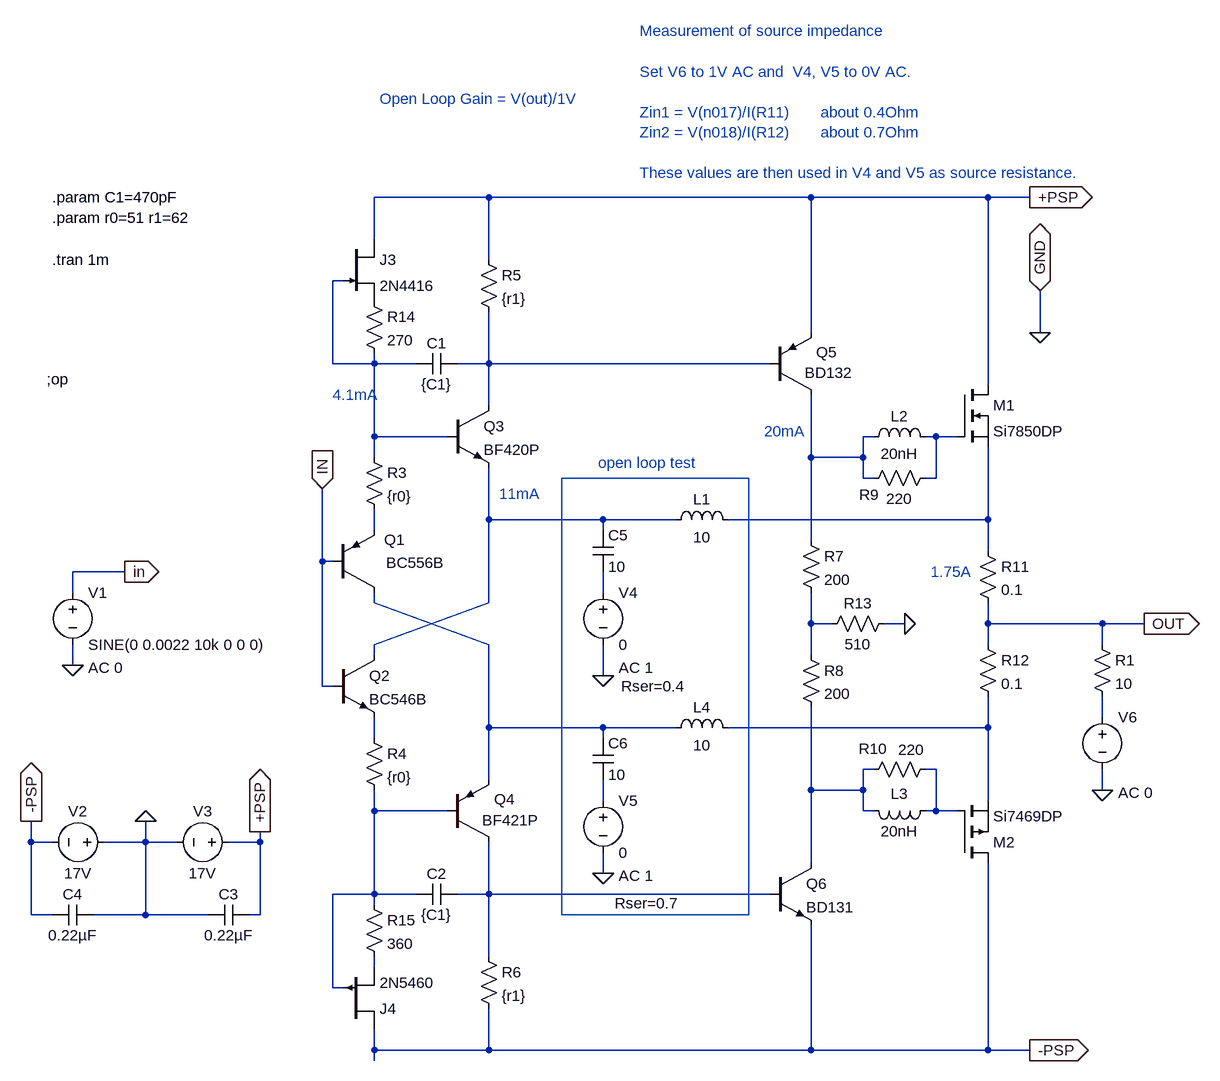
[diagram p0: schematic 8wBalmosModOpenLoop.asc]
8wBalmosModOpenLoop.asc, the LTspice schematic file:
Version 4
SHEET 1 3400 1124
WIRE 1136 -560 960 -560
WIRE 1632 -560 1136 -560
WIRE 1904 -560 1632 -560
WIRE 1968 -560 1904 -560
WIRE 960 -496 960 -560
WIRE 1136 -464 1136 -560
WIRE 912 -432 896 -432
WIRE 1632 -352 1632 -560
WIRE 1984 -352 1984 -416
WIRE 896 -304 896 -432
WIRE 960 -304 960 -320
WIRE 960 -304 896 -304
WIRE 1024 -304 960 -304
WIRE 1136 -304 1136 -384
WIRE 1136 -304 1088 -304
WIRE 1568 -304 1136 -304
WIRE 1904 -272 1904 -560
WIRE 1136 -240 1136 -304
WIRE 960 -192 960 -304
WIRE 1072 -192 960 -192
WIRE 1728 -192 1712 -192
WIRE 1824 -192 1808 -192
WIRE 1856 -192 1824 -192
WIRE 960 -160 960 -192
WIRE 1632 -160 1632 -256
WIRE 1712 -160 1712 -192
WIRE 1712 -160 1632 -160
WIRE 1712 -128 1712 -160
WIRE 1728 -128 1712 -128
WIRE 1824 -128 1824 -192
WIRE 1824 -128 1808 -128
WIRE 1136 -64 1136 -144
WIRE 1312 -64 1136 -64
WIRE 1424 -64 1312 -64
WIRE 1904 -64 1904 -176
WIRE 1904 -64 1504 -64
WIRE 960 -48 960 -80
WIRE 1312 -48 1312 -64
WIRE 1632 -32 1632 -160
WIRE 1904 -16 1904 -64
WIRE 880 0 880 -112
WIRE 896 0 880 0
WIRE 576 16 496 16
WIRE 496 48 496 16
WIRE 1312 48 1312 16
WIRE 960 64 960 48
WIRE 1136 64 1136 -64
WIRE 1632 96 1632 48
WIRE 1664 96 1632 96
WIRE 1776 96 1744 96
WIRE 1904 96 1904 64
WIRE 2080 96 1904 96
WIRE 2144 96 2080 96
WIRE 960 128 1136 64
WIRE 1136 128 960 64
WIRE 1904 128 1904 96
WIRE 2080 128 2080 96
WIRE 960 144 960 128
WIRE 1632 144 1632 96
WIRE 496 160 496 128
WIRE 1312 176 1312 128
WIRE 880 192 880 0
WIRE 896 192 880 192
WIRE 2080 240 2080 208
WIRE 1136 256 1136 128
WIRE 1312 256 1136 256
WIRE 1424 256 1312 256
WIRE 1904 256 1904 208
WIRE 1904 256 1504 256
WIRE 960 272 960 240
WIRE 1312 272 1312 256
WIRE 1728 320 1712 320
WIRE 1824 320 1808 320
WIRE 1136 336 1136 256
WIRE 1632 352 1632 224
WIRE 1712 352 1712 320
WIRE 1712 352 1632 352
WIRE 2080 352 2080 320
WIRE 1312 368 1312 336
WIRE 1904 368 1904 256
WIRE 960 384 960 352
WIRE 1072 384 960 384
WIRE 1712 384 1712 352
WIRE 1728 384 1712 384
WIRE 1824 384 1824 320
WIRE 1824 384 1808 384
WIRE 1856 384 1824 384
WIRE 432 432 432 400
WIRE 464 432 432 432
WIRE 608 432 608 400
WIRE 608 432 544 432
WIRE 656 432 608 432
WIRE 784 432 784 416
WIRE 784 432 736 432
WIRE 1632 464 1632 352
WIRE 1312 480 1312 448
WIRE 960 512 960 384
WIRE 960 512 896 512
WIRE 1024 512 960 512
WIRE 1136 512 1136 432
WIRE 1136 512 1088 512
WIRE 1568 512 1136 512
WIRE 960 528 960 512
WIRE 432 544 432 432
WIRE 464 544 432 544
WIRE 608 544 608 432
WIRE 608 544 528 544
WIRE 704 544 608 544
WIRE 784 544 784 432
WIRE 784 544 768 544
WIRE 1136 608 1136 512
WIRE 960 624 960 608
WIRE 896 656 896 512
WIRE 912 656 896 656
WIRE 960 752 960 720
WIRE 1136 752 1136 688
WIRE 1136 752 960 752
WIRE 1632 752 1632 560
WIRE 1632 752 1136 752
WIRE 1904 752 1904 464
WIRE 1904 752 1632 752
WIRE 1968 752 1904 752
WIRE 960 768 960 752
FLAG 1968 -560 +PSP
IOPIN 1968 -560 Out
FLAG 1968 752 -PSP
IOPIN 1968 752 Out
FLAG 880 -112 IN
IOPIN 880 -112 In
FLAG 2144 96 OUT
IOPIN 2144 96 Out
FLAG 1984 -416 GND
IOPIN 1984 -416 BiDir
FLAG 1984 -352 0
FLAG 1776 96 0
FLAG 496 160 0
FLAG 576 16 in
IOPIN 576 16 Out
FLAG 432 400 -PSP
IOPIN 432 400 Out
FLAG 784 416 +PSP
IOPIN 784 416 Out
FLAG 608 400 0
FLAG 1312 480 0
FLAG 2080 352 0
FLAG 1312 176 0
SYMBOL npn 896 144 R0
SYMATTR InstName Q2
SYMATTR Value BC546B
SYMBOL pnp 896 48 M180
WINDOW 0 79 81 Left 0
WINDOW 3 82 46 Left 0
SYMATTR InstName Q1
SYMATTR Value BC556B
SYMBOL npn 1072 -240 R0
SYMATTR InstName Q3
SYMATTR Value BF420P
SYMBOL res 1120 -480 R0
SYMATTR InstName R5
SYMATTR Value {r1}
SYMBOL res 1120 592 R0
SYMATTR InstName R6
SYMATTR Value {r1}
SYMBOL res 1616 128 R0
SYMATTR InstName R8
SYMATTR Value 200
SYMBOL pnp 1072 432 M180
WINDOW 0 72 66 Left 0
WINDOW 3 54 34 Left 0
SYMATTR InstName Q4
SYMATTR Value BF421P
SYMBOL res 944 -176 R0
SYMATTR InstName R3
SYMATTR Value {r0}
SYMBOL res 944 256 R0
SYMATTR InstName R4
SYMATTR Value {r0}
SYMBOL res 1888 -32 R0
SYMATTR InstName R11
SYMATTR Value 0.1
SYMBOL res 1888 112 R0
SYMATTR InstName R12
SYMATTR Value 0.1
SYMBOL res 1712 -112 R270
WINDOW 0 -25 9 VTop 0
WINDOW 3 0 56 VBottom 0
SYMATTR InstName R9
SYMATTR Value 220
SYMBOL ind 1712 -176 R270
WINDOW 0 32 56 VTop 0
WINDOW 3 5 56 VBottom 0
SYMATTR InstName L2
SYMATTR Value 20nH
SYMBOL res 1824 304 R90
WINDOW 0 0 97 VBottom 0
WINDOW 3 -30 38 VTop 0
SYMATTR InstName R10
SYMATTR Value 220
SYMBOL ind 1824 368 R90
WINDOW 0 5 56 VBottom 0
WINDOW 3 32 56 VTop 0
SYMATTR InstName L3
SYMATTR Value 20nH
SYMBOL npn 1568 464 R0
SYMATTR InstName Q6
SYMATTR Value BD131
SYMBOL pnp 1568 -256 M180
WINDOW 0 72 66 Left 0
WINDOW 3 54 34 Left 0
SYMATTR InstName Q5
SYMATTR Value BD132
SYMBOL cap 1088 -320 R90
WINDOW 0 0 32 VBottom 0
WINDOW 3 32 32 VTop 0
SYMATTR InstName C1
SYMATTR Value {C1}
SYMBOL cap 1088 496 R90
WINDOW 0 0 32 VBottom 0
WINDOW 3 32 32 VTop 0
SYMATTR InstName C2
SYMATTR Value {C1}
SYMBOL res 1616 -48 R0
SYMATTR InstName R7
SYMATTR Value 200
SYMBOL res 1760 80 R90
WINDOW 0 0 56 VBottom 0
WINDOW 3 32 56 VTop 0
SYMATTR InstName R13
SYMATTR Value 510
SYMBOL voltage 496 32 R0
WINDOW 123 24 132 Left 0
WINDOW 39 0 0 Left 0
SYMATTR Value2 AC 0
SYMATTR InstName V1
SYMATTR Value SINE(0 0.0022 10k 0 0 0)
SYMBOL voltage 560 432 R90
WINDOW 0 -32 56 VBottom 0
WINDOW 3 32 56 VTop 0
SYMATTR InstName V2
SYMATTR Value 17V
SYMBOL cap 768 560 M270
WINDOW 0 32 32 VTop 0
WINDOW 3 0 32 VBottom 0
SYMATTR InstName C3
SYMATTR Value 0.22µF
SYMBOL cap 528 560 M270
WINDOW 3 0 32 VBottom 0
WINDOW 0 32 32 VTop 0
SYMATTR Value 0.22µF
SYMATTR InstName C4
SYMBOL voltage 752 432 R90
WINDOW 0 -32 56 VBottom 0
WINDOW 3 32 56 VTop 0
SYMATTR InstName V3
SYMATTR Value 17V
SYMBOL njf 912 -496 R0
SYMATTR InstName J3
SYMATTR Value 2N4416
SYMBOL res 944 -416 R0
SYMATTR InstName R14
SYMATTR Value 270
SYMBOL pjf 912 720 M180
SYMATTR InstName J4
SYMATTR Value 2N5460
SYMBOL res 944 512 R0
SYMATTR InstName R15
SYMATTR Value 360
SYMBOL ind 1408 -48 R270
WINDOW 0 32 56 VTop 0
WINDOW 3 5 56 VBottom 0
SYMATTR InstName L1
SYMATTR Value 10
SYMBOL ind 1408 272 R270
WINDOW 0 32 56 VTop 0
WINDOW 3 5 56 VBottom 0
SYMATTR InstName L4
SYMATTR Value 10
SYMBOL voltage 1312 32 R0
WINDOW 123 24 132 Left 0
WINDOW 39 28 160 Left 0
SYMATTR Value2 AC 1
SYMATTR SpiceLine Rser=0.4
SYMATTR InstName V4
SYMATTR Value 0
SYMBOL voltage 1312 352 R0
WINDOW 123 24 132 Left 0
WINDOW 39 18 174 Left 0
SYMATTR Value2 AC 1
SYMATTR SpiceLine Rser=0.7
SYMATTR InstName V5
SYMATTR Value 0
SYMBOL res 2064 112 R0
SYMATTR InstName R1
SYMATTR Value 10
SYMBOL cap 1296 -48 R0
SYMATTR InstName C5
SYMATTR Value 10
SYMBOL cap 1296 272 R0
SYMATTR InstName C6
SYMATTR Value 10
SYMBOL voltage 2080 224 R0
WINDOW 123 24 132 Left 0
WINDOW 39 0 0 Left 0
SYMATTR Value2 AC 0
SYMATTR InstName V6
SYMATTR Value ""
SYMBOL nmos 1856 -272 R0
SYMATTR InstName M1
SYMATTR Value Si7850DP
SYMBOL pmos 1856 464 M180
SYMATTR InstName M2
SYMATTR Value Si7469DP
TEXT 464 -560 Left 0 !.param C1=470pF\n.param r0=51 r1=62
TEXT 896 -256 Left 0 ;4.1mA
TEXT 1560 -200 Left 0 ;20mA
TEXT 1816 16 Left 0 ;1.75A
TEXT 1152 -104 Left 0 ;11mA
TEXT 456 -280 Left 0 !;op
TEXT 464 -464 Left 0 !.tran 1m
TEXT 968 -712 Left 0 ;Open Loop Gain = V(out)/1V
TEXT 1304 -152 Left 0 ;open loop test
TEXT 1368 -816 Left 0 ;Measurement of source impedance\n \nSet V6 to 1V AC and  V4, V5 to 0V AC.\n \nZin1 = V(n017)/I(R11)       about 0.4Ohm\nZin2 = V(n018)/I(R12)       about 0.7Ohm\n \nThese values are then used in V4 and V5 as source resistance.
RECTANGLE Normal 1536 544 1248 -128

The netlist it stands for:
* 8wBalmosModOpenLoop.asc
Q2 N005 IN N013 0 BC546B
Q1 N009 IN N007 0 BC556B
Q3 N002 N001 N005 0 BF420P
R5 +PSP N002 {r1}
R6 N018 -PSP {r1}
R8 N010 N014 200
Q4 N018 N017 N009 0 BF421P
R3 N001 N007 {r0}
R4 N013 N017 {r0}
R11 N006 OUT 0.1
R12 OUT N012 0.1
R9 N003 N004 220
L2 N003 N004 20nH
R10 N015 N014 220
L3 N015 N014 20nH
Q6 N014 N018 -PSP 0 BD131
Q5 N003 N002 +PSP 0 BD132
C1 N002 N001 {C1}
C2 N018 N017 {C1}
R7 N003 N010 200
R13 0 N010 510
V1 IN 0 SINE(0 0.0022 10k 0 0 0) AC 0
V2 0 -PSP 17V
C3 +PSP 0 0.22µF
C4 0 -PSP 0.22µF
V3 +PSP 0 17V
J3 +PSP N001 P001 2N4416
R14 P001 N001 270
J4 -PSP N017 N019 2N5460
R15 N017 N019 360
L1 N005 N006 10
L4 N009 N012 10
V4 N008 0 0 AC 1 Rser=0.4
V5 N016 0 0 AC 1 Rser=0.7
R1 OUT N011 10
C5 N005 N008 10
C6 N009 N016 10
V6 N011 0 AC 0
M1 +PSP N004 N006 N006 Si7850DP
M2 -PSP N015 N012 N012 Si7469DP
.model NPN NPN
.model PNP PNP
.lib standard.bjt
.model NJF NJF
.model PJF PJF
.lib standard.jft
.model NMOS NMOS
.model PMOS PMOS
.lib standard.mos
.param C1=470pF
.param r0=51 r1=62
* 4.1mA
* 20mA
* 1.75A
* 11mA
;op
.tran 1m
* Open Loop Gain = V(out)/1V
* open loop test
* Measurement of source impedance
* Set V6 to 1V AC and  V4, V5 to 0V AC.
* Zin1 = V(n017)/I(R11)       about 0.4Ohm
* Zin2 = V(n018)/I(R12)       about 0.7Ohm
* These values are then used in V4 and V5 as source resistance.
.backanno
.end